# EAGLE design UP-Tasterschnittstelle1.2 (EAGLE 5.02)
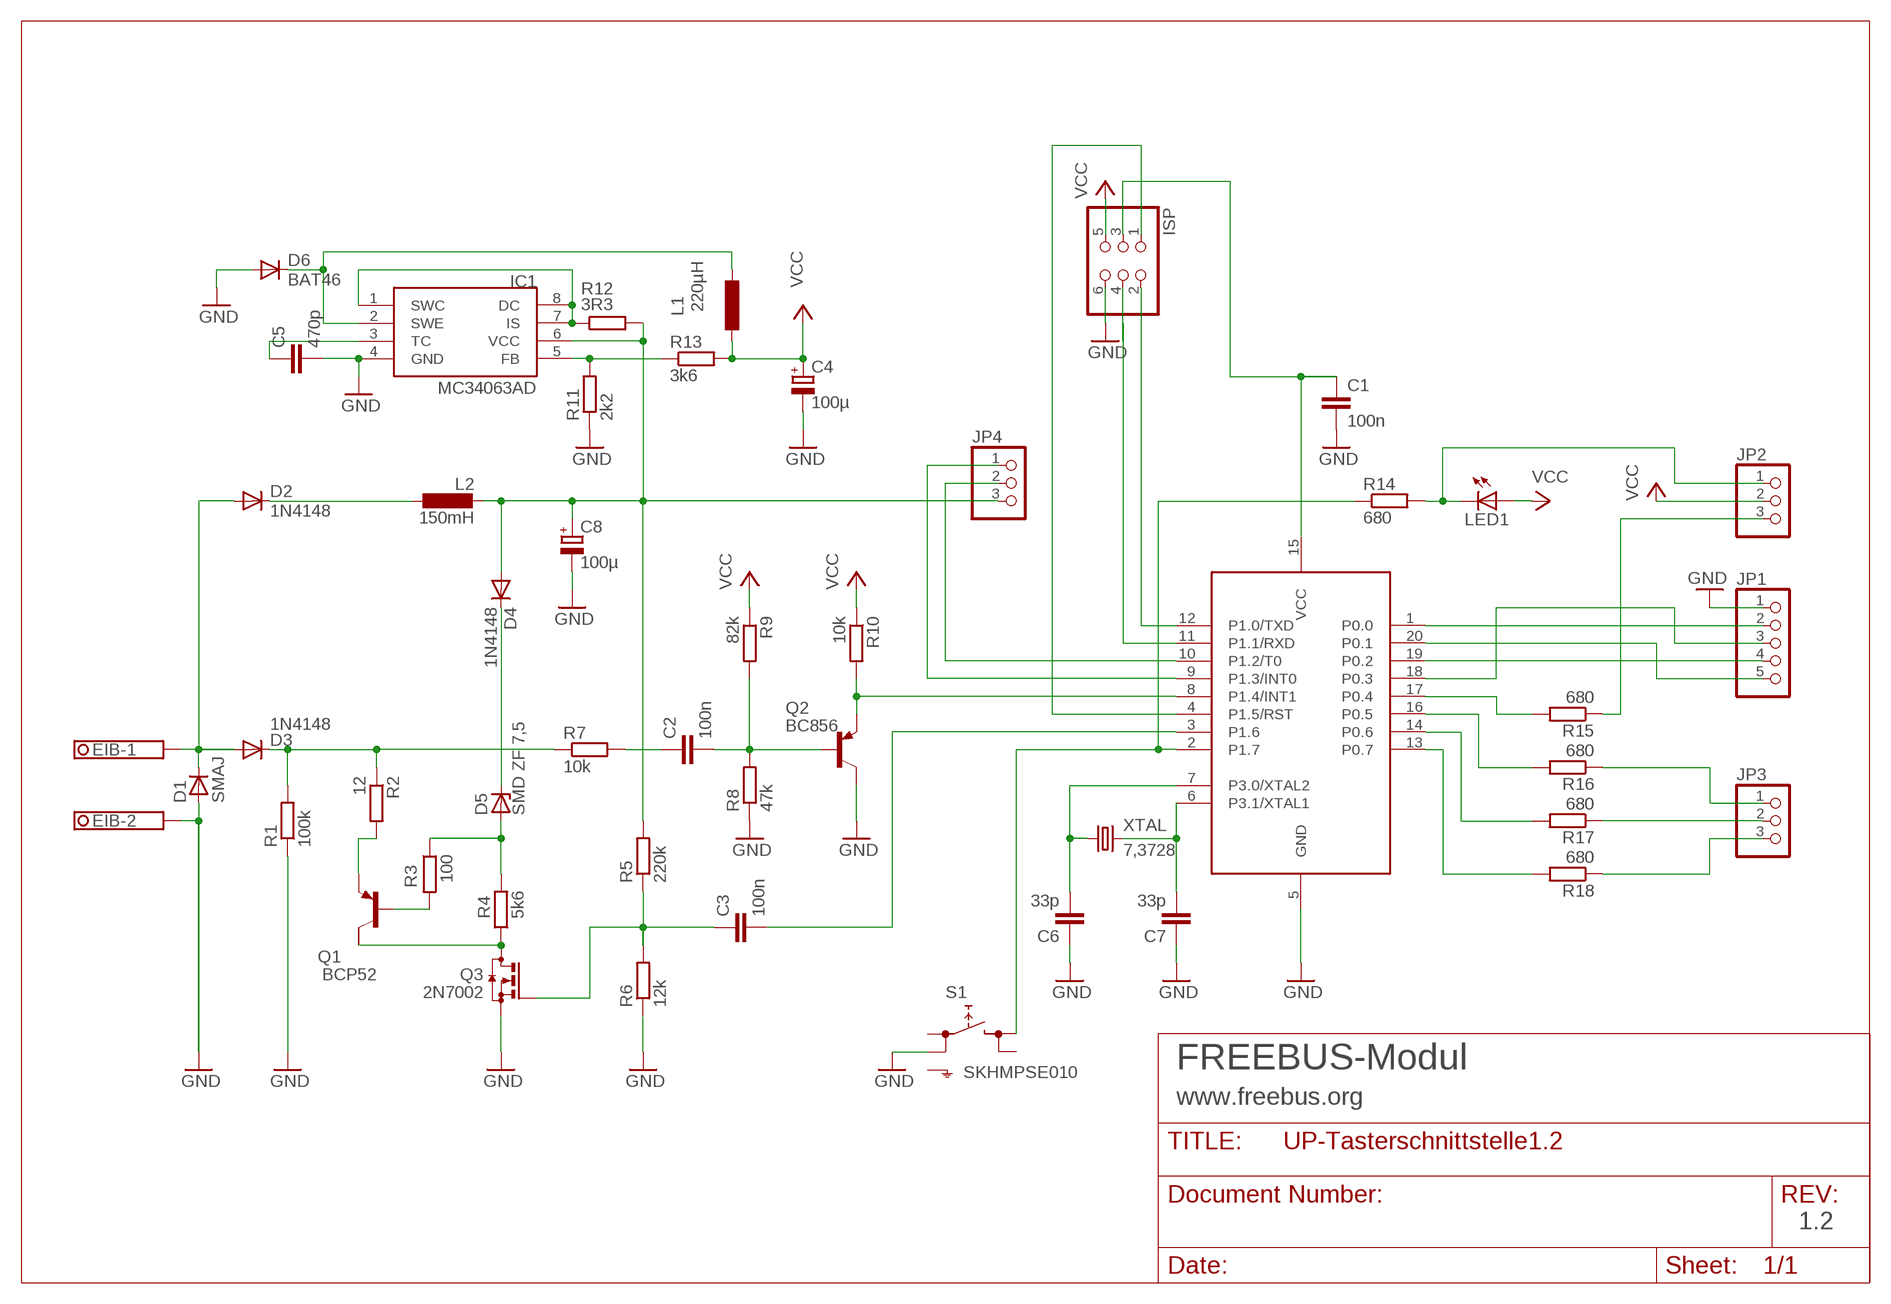
[diagram p0: schematic, sheet 1]

## Parts
C1  100n  C-EUC1206  [C1206]
C2  100n  C-EUC1206  [C1206]
C3  100n  C-EUC1206  [C1206]
C4  100µ  RCL_C_EU_H2-5X11  [2-5X11]
C5  470p  C-EUC1206  [C1206]
C6  33p  C-EUC1206  [C1206]
C7  33p  C-EUC1206  [C1206]
C8  100µ  RCL_C_EU_H3,5-8X13  [3,5-8X13]
D1  SMAJ  D-SMB  [SMB]
D2  1N4148  DIODE-MINIMELF  [MINIMELF]
D3  1N4148  DIODE-MINIMELF  [MINIMELF]
D4  1N4148  DIODE-MINIMELF  [MINIMELF]
D5  SMD ZF 7,5  ZPD  [MINIMELF]
D6  BAT46  DIODE-MINIMELF  [MINIMELF]
EIB  1751248  [1751248]
IC1  MC34063AD  [SOIC8]
IC2  LPC922FDH  [TSSOP20]
ISP  PINHD-2X3_2.00  [2X03M]
JP1  PINHD-1X5_2.00_STECKER  [1X5]
JP2  PINHD-1X3_2.00_STECKER  [1X3]
JP3  PINHD-1X3_2.00_STECKER  [1X3]
JP4  PINHD-1X3_2.00  [1X03M]
L1  220µH  L-EU2200-12.7  [2200-12.7]
L2  150mH  RCL_L-11P11PH  [RCL_11PH]
LED1  LEDCHIPLED_1206  [CHIPLED_1206]
Q1  BCP52  FZT753SMD  [SOT223]
Q2  BC856  BC856ALT1SMD  [SOT23-BEC]
Q3  2N7002  BSS123  [SOT23]
R1  100k  R-EU_M1206  [M1206]
R2  12  R-EU_R1206  [R1206]
R3  100  R-EU_R1206  [R1206]
R4  5k6  R-EU_R1206  [R1206]
R5  220k  R-EU_R1206  [R1206]
R6  12k  R-EU_R1206  [R1206]
R7  10k  R-EU_R1206  [R1206]
R8  47k  R-EU_M1206  [M1206]
R9  82k  R-EU_R1206  [R1206]
R10  10k  R-EU_R1206  [R1206]
R11  2k2  R-EU_R1206  [R1206]
R12  3R3  R-EU_M1206  [M1206]
R13  3k6  R-EU_M1206  [M1206]
R14  680  R-EU_R1206  [R1206]
R15  680  R-EU_R1206  [R1206]
R16  680  R-EU_R1206  [R1206]
R17  680  R-EU_R1206  [R1206]
R18  680  R-EU_R1206  [R1206]
S1  SKHMPSE010  [SKHMPXE010]
XTAL  7,3728  CRYSTAL_CRYSTALHC49S  [CRYSTAL_HC49/S]

## Nets
GND: C1.2 C4.- C5.2 C6.1 C7.1 C8.- D1.2(A) D6.A EIB.2 IC1.4(GND) IC2.5(GND) ISP.6 JP1.1 Q2.C Q3.2(S) R1.1 R6.1 R8.1 R11.1 S1.2(1.2)
IO1: IC2.1(P0.0) JP1.2
IO2: IC2.20(P0.1) JP1.5
IO3: IC2.19(P0.2) JP1.4
IO4: IC2.18(P0.3) JP1.3
LED1: JP2.3 R15.1
LED2: JP3.1 R16.1
LED3: JP3.2 R17.1
LED4: JP3.3 R18.1
N$5: C7.2 IC2.6(P3.1/XTAL1) XTAL.2
N$6: C6.2 IC2.7(P3.0/XTAL2) XTAL.1
N$7: C2.1 R7.2
N$8: IC2.2(P1.7) R14.1 S1.3(2.1)
N$10: IC2.9(P1.3/INT0) JP4.1
N$11: IC2.17(P0.4) R15.2
N$12: C8.+ D4.A IC1.6(VCC) JP4.3 L2.P$2 R5.2 R12.2
N$13: IC2.10(P1.2/T0) JP4.2
N$14: IC2.16(P0.5) R16.2
N$15: IC2.14(P0.6) R17.2
N$16: IC2.13(P0.7) R18.2
N$19: IC2.8(P1.4/INT1) Q2.E R10.2
N$23: C2.2 Q2.B R8.2 R9.2
N$24: C3.2 IC2.3(P1.6)
N$25: D3.C R1.2 R2.1 R7.1
N$26: IC1.5(FB) R11.2 R13.1
N$27: D6.C IC1.2(SWE) L1.2
N$28: C5.1 IC1.3(TC)
N$34: C3.1 Q3.1(G) R5.1 R6.2
N$36: D2.C L2.P$1
N$37: Q1.2(C) Q3.3(D) R4.1
N$38: D5.A R3.1 R4.2
N$39: Q1.3(E) R2.2
N$40: Q1.1(B) R3.2
N$41: D4.C D5.C
N$51: D1.1(C) D2.A D3.A EIB.1
N$61: IC1.1(SWC) IC1.7(IS) IC1.8(DC) R12.1
PROG_LED: JP2.1 LED1.C R14.2
RST: IC2.4(P1.5/RST) ISP.1
RXD: IC2.11(P1.1/RXD) ISP.4
TXD: IC2.12(P1.0/TXD) ISP.2
VCC: C4.+ ISP.5 JP2.2 L1.1 LED1.A R9.1 R10.1 R13.2
VCC_IN: C1.1 IC2.15(VCC) ISP.3
Unconnected: Q1.4(C/) S1.1(1.1) S1.4(2.2) S1.5(SH)

## Notes on the sheet
- FREEBUS-Modul
- www.freebus.org
- 1.2

## Library data of the parts
C1-C3 C5-C7 = rcl:C-EU: CAPACITOR, European symbol
C4 C8 = LPC_Gira3:RCL_C_EU_H
D1 = semicon-smd-ipc:D-: DIODE unfilled
D2-D4 D6 = diode:DIODE-: DIODE
D5 = diode:ZPD: Z DIODE 500 mW
EIB = con-phoenix-350:1751248: MKDS 1/ 2-3,5 Printklemme Nennstrom: 10 A Bemessungsspannung: 160 V Raster: 3,5 mm Polzahl: 2 Montageart: Löten Anschlussart: Schraubanschluss Anschlussrichtung vom Leiter zur Platine: 0° Source: http://eshop.phoenixcontact.com .. 1751248.pdf
IC1 = mc34063:MC34063
IC2 = LPCGira:LPC922FDH
ISP = pinhead2:PINHD-2X3: PIN HEADER
JP1 = pinhead2:PINHD-1X5: PIN HEADER
JP2-JP4 = pinhead2:PINHD-1X3: PIN HEADER
L1 = rcl:L-EU: INDUCTOR, European symbol
L2 = LPC_Gira3:RCL_L-11P
LED1 = led:LED: LED OSRAM: - CHIPLED LG R971, LG N971, LY N971, LG Q971, LY Q971, LO R971, LY R971 LH N974, LH R974 LS Q976, LO Q976, LY Q976 LO Q996 - Hyper CHIPLED LW Q18S LB Q993, LB Q99A, LB R99A - SideLED LS A670, LO A670, LY A670, LG A670, LP A670 LB A673, LV A673, LT A673, LW A673 LH A674 LY A675 LS A676, LA A676, LO A676, LY A676, LW A676 LS A679, LY A679, LG A679 - Hyper Micro SIDELED® LS Y876, LA Y876, LO Y876, LY Y876 LT Y87S - SmartLED LW L88C, LW L88S LB L89C, LB L89S, LG L890 LS L89K, LO L89K, LY L89K LS L896, LA L896, LO L896, LY L896 - TOPLED LS T670, LO T670, LY T670, LG T670, LP T670 LSG T670, LSP T670, LSY T670, LOP T670, LYG T670 LG T671, LOG T671, LSG T671 LB T673, LV T673, LT T673, LW T673 LH T674 LS T676, LA T676, LO T676, LY T676, LB T676, LH T676, LSB T676, LW T676 LB T67C, LV T67C, LT T67C, LS T67K, LO T67K, LY T67K, LW E67C LS E67B, LA E67B, LO E67B, LY E67B, LB E67C, LV E67C, LT E67C LW T67C LS T679, LY T679, LG T679 LS T770, LO T770, LY T770, LG T770, LP T770 LB T773, LV T773, LT T773, LW T773 LH T774 LS E675, LA E675, LY E675, LS T675 LS T776, LA T776, LO T776, LY T776, LB T776 LHGB T686 LT T68C, LB T68C - Hyper Mini TOPLED® LB M676 - Mini TOPLED Santana® LG M470 LS M47K, LO M47K, LY M47K Source: http://www.osram.convergy.de - LUMILED® LXK2-PW12-R00, LXK2-PW12-S00, LXK2-PW14-U00, LXK2-PW14-V00 LXK2-PM12-R00, LXK2-PM12-S00, LXK2-PM14-U00 LXK2-PE12-Q00, LXK2-PE12-R00, LXK2-PE12-S00, LXK2-PE14-T00, LXK2-PE14-U00 LXK2-PB12-K00, LXK2-PB12-L00, LXK2-PB12-M00, LXK2-PB14-N00, LXK2-PB14-P00, LXK2-PB14-Q00 LXK2-PR12-L00, LXK2-PR12-M00, LXK2-PR14-Q00, LXK2-PR14-R00 LXK2-PD12-Q00, LXK2-PD12-R00, LXK2-PD12-S00 LXK2-PH12-R00, LXK2-PH12-S00 LXK2-PL12-P00, LXK2-PL12-Q00, LXK2-PL12-R00 Source: www.luxeon.com
Q1 = transistor-pnp:FZT753SMD: PNP Transistor
Q2 = transistor-pnp:BC856*: PNP Transistror
Q3 = transistor-small-signal:BSS123: N-CHANNEL MOS FET
R1-R18 = rcl:R-EU_: RESISTOR, European symbol
S1 = switch:SKHMP*E010: 6.2 X 6.5mm TACT Switch (SMD) Source: http://www3.alps.co.jp/WebObjects/catalog.woa/PDF/E/Switch/Tact/SKHM/SKHM.PDF
XTAL = LPCGira:CRYSTAL_CRYSTAL: CRYSTAL

## Board
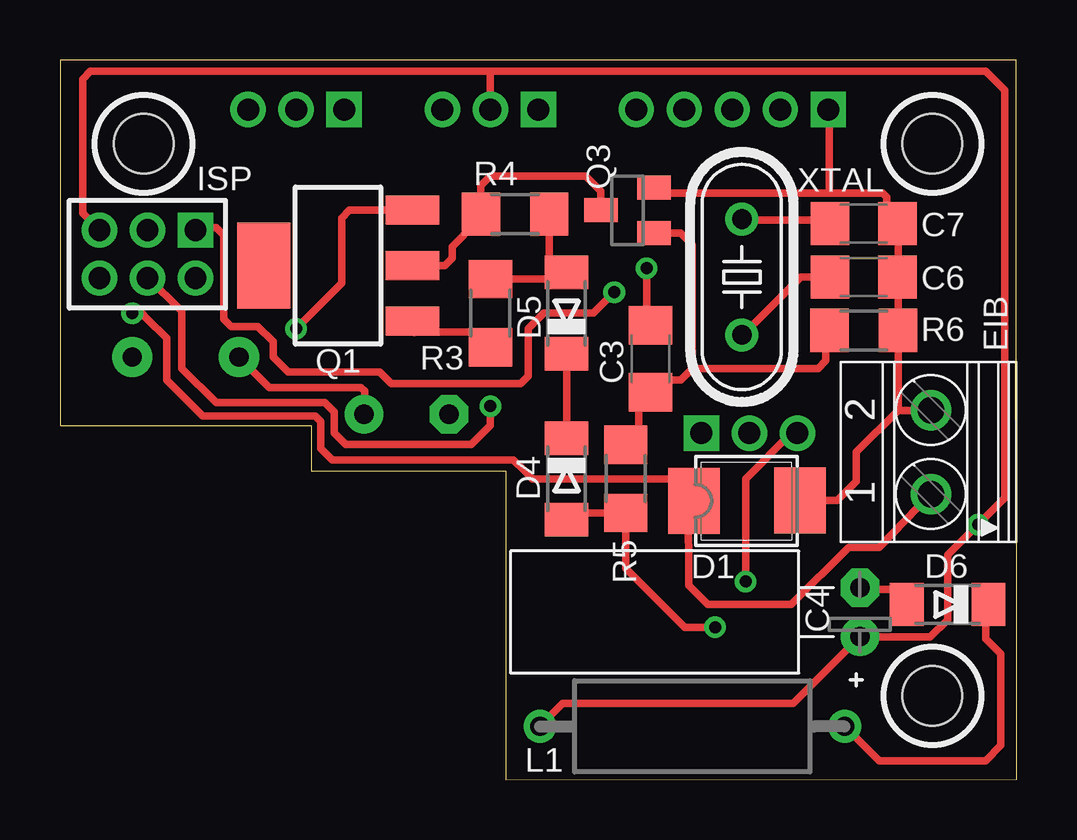
[diagram p1: board, top side]
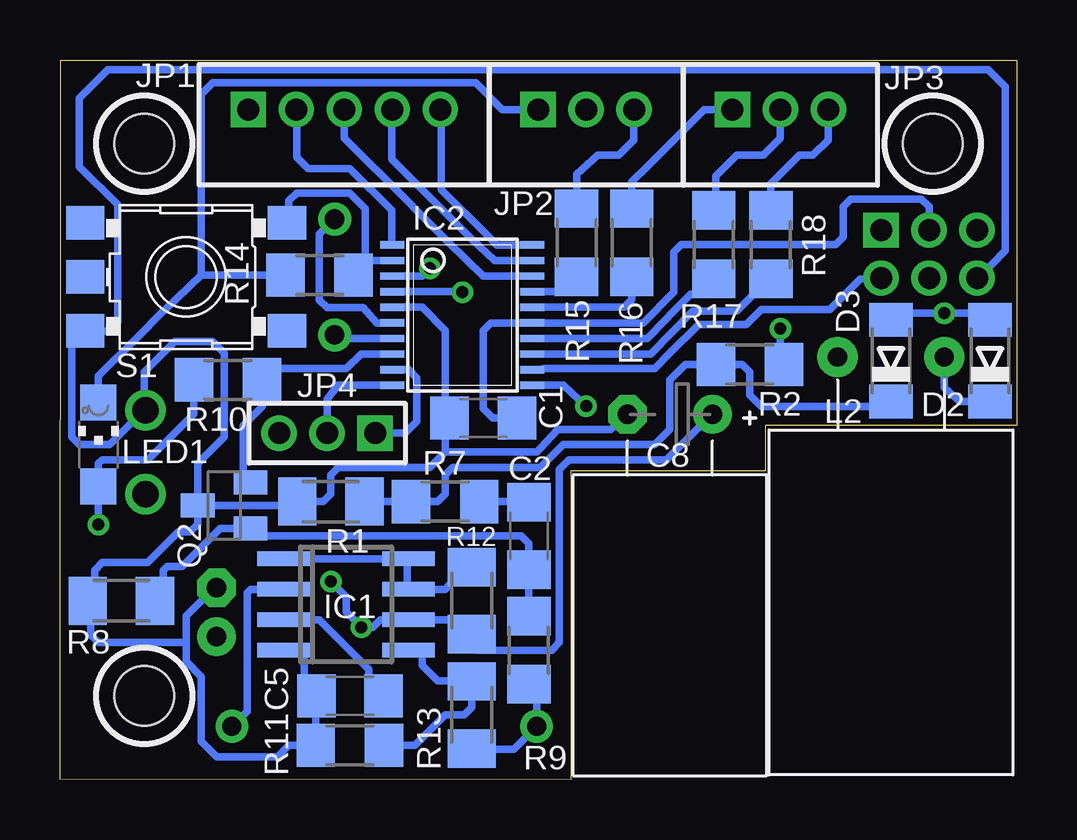
[diagram p2: board, bottom side, seen from below]

Size 39.85 x 30 mm. Coordinates in mm from the lower left corner, seen from the top.
Outline: 39.83,30 39.85,0.01 18.57,0 18.57,12.86 10.47,12.86 10.47,14.77 0,14.77 0,30 27.77,30 39.83,30
Outline: 39.84,30 39.83,30
Copper layers (1*16): Top 0.035mm / dielectric 1.5mm / Bottom 0.035mm
Design rules "ZWILLING 11mil": minimum track width 0.2mm, minimum drill 0.5mm, track to track 0.2mm, track to pad 0.2mm, pad to pad 0.2mm, via to via 0.2mm, smd to smd 0mil, copper to edge 0.2mm, drill to drill 0.2mm, minimum pad ring 11mil, minimum via ring 0.2mm, stop-mask expansion 0.1mm, vias tented up to drill 0mil, thermal gap 10mil
Holes 2.49 mm at 3.49,26.51 36.35,3.49 36.35,26.51

### Footprints (pad centres in the part's own frame; a part is rotated, then mirrored left to right if it is on the bottom)
C1206 = smd 1.6 x 1.8: 1 -1.4,0; 2 1.4,0
2-5X11 = drill 0.813 pad 1.6 round: + -1.02,0 | drill 0.813 pad 1.6 octagon: - 1.02,0
3,5-8X13 = drill 0.813 pad 1.6 round: + -1.77,-0.31 | drill 0.813 pad 1.6 octagon: - 1.77,-0.31
SMB = smd 2.159 x 2.743: 1 -2.311,-0.127; 2 2.108,-0.102
MINIMELF = smd 1.4 x 1.8: A 1.7,0; C -1.7,0
1751248 = drill 1.1 pad 1.7 round: 1 -1.75,-0.1; 2 1.75,-0.1
SOIC8 = smd 0.6 x 2.2: 1 -1.905,-2.6; 2 -0.635,-2.6; 3 0.635,-2.6; 4 1.905,-2.6; 5 1.905,2.6; 6 0.635,2.6; 7 -0.635,2.6; 8 -1.905,2.6
TSSOP20 = smd 0.305 x 0.991: 1 -2.925,-2.918; 2 -2.275,-2.918; 3 -1.625,-2.918; 4 -0.975,-2.918; 5 -0.325,-2.918; 6 0.325,-2.918; 7 0.975,-2.918; 8 1.625,-2.918; 9 2.275,-2.918; 10 2.925,-2.918; 11 2.925,2.918; 12 2.275,2.918; 13 1.625,2.918; 14 0.975,2.918; 15 0.325,2.918; 16 -0.325,2.918; 17 -0.975,2.918; 18 -1.625,2.918; 19 -2.275,2.918; 20 -2.925,2.918
2X03M = drill 0.914 square: 1 -2,-1 | drill 0.914 round: 2 -2,1; 3 0,-1; 4 0,1; 5 2,-1; 6 2,1
1X5 = drill 0.914 square: 1 -4,0 | drill 0.914 round: 2 -2,0; 3 0,0; 4 2,0; 5 4,0
1X3 = drill 0.914 square: 1 -2,0 | drill 0.914 round: 2 0,0; 3 2,0
1X03M = drill 0.914 square: 1 -2,0 | drill 0.914 round: 2 0,0; 3 2,0
2200-12.7 = drill 0.8 pad 1.27 round: 1 -6.35,0; 2 6.35,0
RCL_11PH = drill 0.8 pad 1.676 round: P$1 -2.223,0; P$2 2.223,0
CHIPLED_1206 = smd 1.5 x 1.5: A 0,-1.75; C 0,1.75
SOT223 = smd 1.219 x 2.235: 1 -2.311,-3.099; 2 0,-3.099; 3 2.311,-3.099 | smd 3.6 x 2.2: 4 0,3.099
SOT23-BEC = smd 1 x 1.4: B -0.95,-1.1; C 0,1.1; E 0.95,-1.1
SOT23 = smd 1 x 1.4: 1 -0.95,-1.1; 2 0.95,-1.1; 3 0,1.1
M1206 = smd 1.6 x 2: 1 -1.4,0; 2 1.4,0
R1206 = smd 1.6 x 1.803: 1 -1.422,0; 2 1.422,0
SKHMPXE010 = smd 1.6 x 1.4: 1 -4.2,2.25; 2 4.2,2.25; 3 -4.2,-2.25; 4 4.2,-2.25; 5 4.2,0
CRYSTAL_HC49/S = drill 0.813 round: 1 -2.413,0; 2 2.413,0

### Placement (x,y rotation side)
C1  22.22,15.08 180 bottom
C2  20.31,10.16 270 bottom
C3  24.6,17.54 90 top
C4  33.33,6.99 90 top
C5  27.78,3.49 180 bottom
C6  33.49,20.95 180 top
C7  33.49,23.18 180 top
C8  14.44,14.92 180 bottom
D1  28.73,11.75 0 top
D2  1.11,17.46 90 bottom
D3  5.23,17.46 90 bottom
D4  21.11,12.54 270 top
D5  21.11,19.45 90 top
D6  36.98,7.3 180 top
EIB  36.19,13.65 90 top
IC1  27.93,7.3 270 bottom
IC2  23.09,19.37 270 bottom
ISP  3.65,21.91 180 top
JP1  28.01,27.94 0 bottom
JP2  17.93,27.94 0 bottom
JP3  9.84,27.94 0 bottom
JP4  28.73,14.45 180 bottom
L1  26.35,2.22 0 top
L2  5.23,17.62 180 bottom
LED1  38.25,13.97 0 bottom
Q1  11.58,21.43 90 top
Q2  33.01,11.43 90 bottom
Q3  23.65,23.73 90 top
R1  28.57,11.59 0 bottom
R2  11.11,17.3 0 bottom
R3  17.93,19.45 270 top
R4  18.96,23.57 0 top
R5  23.57,12.54 270 top
R6  33.49,18.73 180 top
R7  23.81,11.59 0 bottom
R8  37.3,7.46 0 bottom
R9  20.31,5.4 90 bottom
R10  32.85,16.67 0 bottom
R11  27.78,1.43 0 bottom
R12  22.7,7.46 270 bottom
R13  22.7,2.7 270 bottom
R14  29.05,21.03 180 bottom
R15  18.33,22.38 270 bottom
R16  16.03,22.38 270 bottom
R17  12.61,22.3 270 bottom
R18  10.23,22.3 270 bottom
S1  34.6,20.96 180 bottom
XTAL  28.41,20.96 90 top

### Tracks (layer width: path | path; a pad name or v marks a point on that pad's centre or on a via)
GND
  Top 0.305: D1.2 32.38,11.65 33.17,12.44 33.17,13.65 34.92,15.4 | EIB.2 36.35,15.4 36.19,15.4 34.92,15.4 | C4.- 33.49,7.94 35.24,7.94 35.24,7.3 D6.A | 34.92,20.95 34.92,23.18 | 34.92,15.4 | 34.92,15.4 R6.1 | R6.1 | R6.1 34.92,20.8 | 33.33,24.45 34.28,24.45 34.44,24.29 34.44,23.18 34.92,23.18 | 33.33,24.45 32.06,24.45 | 32.06,24.45 30.95,24.45 27.77,24.45 24.76,24.45 Q3.2 | 34.92,23.18 C7.1 | 34.92,20.8 34.92,20.95 | 34.92,20.95 C6.1 | 34.92,20.8 | 33.33,24.45 | JP1.1 32.06,27.94 32.06,24.45
  Bottom 0.305: 39.05,28.42 37.86,29.61 32.38,29.61 3.33,29.61 1.18,29.61 0.47,28.89 0.47,22.07 1.58,20.91 ISP.6 | 30,11.59 30,11.75 30.16,11.43 Q2.C | 30,11.59 28.89,11.59 28.57,11.91 28.57,12.7 28.25,13.02 24.44,13.02 23.81,13.65 | 19.84,13.81 19.12,14.61 16.9,14.61 16.19,15.23 | 28.57,4.13 C5.2 29.2,3.65 | 34.6,5.71 34.6,6.83 33.33,8.1 C4.- | 29.2,3.65 | 29.2,3.65 29.2,1.91 R11.1 30.31,1.43 30.79,0.95 33.33,0.95 33.97,1.59 33.97,4.29 34.6,4.92 34.6,5.71 | 29.2,3.65 29.68,3.65 29.68,5.4 IC1.4 | 30,11.59 R1.1 | 16.19,15.23 16.19,15.24 | 16.19,15.23 C8.- | 39.05,28.42 | 39.05,28.42 39.05,25.56 37.46,23.97 37.46,19.37 37.46,19.05 37.78,18.7 S1.2 39.36,18.7 39.36,14.29 39.05,13.97 37.78,13.97 36.35,15.4 | 19.84,13.81 20,13.65 23.81,13.65 | 19.84,13.81 | 23.81,13.65 23.81,15.08 | IC2.5 24.76,19.69 23.81,18.73 23.81,15.08 | 23.81,15.08 23.96,15.08 C1.2 | 34.6,5.71 38.25,5.71 38.57,6.03 38.57,7.46 R8.1 38.41,7.46 38.41,8.73 38.09,9.05 36.19,9.05 34.92,10.32 34.44,10.32 34.12,10.64 Q2.C | Q2.C 34.12,13.18 33.01,14.29 33.01,17.78 33.33,18.1 33.49,18.26 35.08,18.26 36.35,16.99 36.35,15.4 | 36.35,15.4 | 36.35,15.4 EIB.2
IO1
  Bottom 0.305: IC2.1 26.03,22.29 26.03,23.73 27.77,25.48 29.52,25.48 30,25.96 | JP1.2 30,27.94 30,25.96 | 30,25.96
IO2
  Bottom 0.305: IC2.20 21.66,22.29 22.06,22.7 | 22.06,22.7 | 22.06,22.7 23.96,24.61 23.96,27.94 JP1.5
IO3
  Bottom 0.305: IC2.19 21.74,21.64 22.69,22.54 | 22.69,22.54 | 22.69,22.54 26.03,25.88 | JP1.4 26.03,27.94 26.03,25.88 | 26.03,25.88
IO4
  Bottom 0.305: IC2.18 22.22,20.99 23.65,22.38 23.96,22.7 24.92,23.65 25.39,24.13 28.01,26.75 JP1.3
LED1
  Bottom 0.305: R15.1 18.33,24.12 18.33,25.24 17.46,26.04 16.58,26.04 15.95,26.67 | JP2.3 15.95,27.94 15.95,26.67 | 15.95,26.67
LED2
  Bottom 0.305: R16.1 16.03,24.92 15.39,25.56 13.01,27.94 JP3.1 11.82,27.94
LED3
  Bottom 0.305: R17.1 12.53,23.73 12.53,25.16 11.66,26.04 10.55,26.04 9.84,26.75 JP3.2
LED4
  Bottom 0.305: R18.1 10.23,24.84 9.04,26.04 8.49,26.04 7.85,26.67 | JP3.3 7.85,27.94 7.85,26.67 | 7.85,26.67
N$5
  Top 0.305: XTAL.2 | C7.2 32.06,23.18 32.06,23.34 28.41,23.34 XTAL.2
  Bottom 0.305: IC2.6 26.66,19.04 27.22,19.68 28.73,19.68 29.04,20 29.04,20.08 29.04,21.91 29.04,22.73 XTAL.2
N$6
  Top 0.305: C6.2 30.87,20.95 28.41,18.49 | 28.41,18.49 XTAL.1 28.41,18.49
  Bottom 0.305: XTAL.1 28.41,18.41 28.41,18.38 27.77,18.39 IC2.7
N$7
  Bottom 0.305: C2.1 20.31,11.59 R7.2
N$8
  Bottom 0.305: 27.14,23.81 27.77,24.45 30,24.45 30.31,24.13 30.31,23.2 S1.3 | R14.1 | R14.1 | 27.14,21.64 27.62,21.64 R14.1 | 27.14,21.64 IC2.2 | 27.14,21.64 27.14,21.59 | 27.14,23.81 | 27.14,21.64 27.14,23.81
N$10
  Bottom 0.305: IC2.9 25.31,17.09 25,16.75 25,14.92 25.47,14.45 JP4.1
N$11
  Bottom 0.305: R15.2 18.88,20.96 18.88,20.34 IC2.17
N$12  (via drill 0.5)
  Top 0.305: v27.3,6.35 26.03,6.35 23.57,8.81 23.57,10.09 R5.2 21.03,11.12 21.03,11.08 D4.A | C8.+ 12.69,15.23 12.69,16.19 12.53,16.35 12.22,16.35 8.72,16.35 L2.P$2 | JP4.3 30.47,14.45 28.57,12.54 v28.57,8.26
  Bottom 0.305: 22.54,6.67 IC1.6 26.5,6.67 26.82,6.35 v27.3,6.35 27.93,6.99 27.93,7.62 v28.57,8.26 | 22.54,6.38 22.54,6.35 | 22.54,6.38 R12.2 | 22.54,6.67 22.54,6.38 | 22.54,6.67 22.54,5.4 19.36,5.4 19.04,5.71 19.04,12.94 18.65,13.34 14.6,13.34 12.69,15.23 | 12.69,15.23 12.69,15.24 | C8.+ 12.69,15.23
N$13
  Bottom 0.305: IC2.10 28.25,16.44 28.73,15.88 JP4.2 | JP4.2
N$14
  Bottom 0.305: R16.2 16.03,20.01 16.34,19.69 IC2.16
N$15
  Bottom 0.305: IC2.14 19.52,18.39 15.39,18.39 14.6,19.21 14.36,19.45 13.57,20.24 12.22,20.25 R17.2
N$16
  Bottom 0.254: 10.63,20.56
  Bottom 0.305: IC2.13 15.23,17.74 13.49,19.53 11.66,19.53 10.63,20.56 R18.2
N$19
  Bottom 0.305: IC2.8 27.3,17.74 27.93,17.14 28.01,17.14 29.52,17.14 29.84,17.14 31.43,17.14 | Q2.E 32.22,12.38 32.22,14.76 31.43,15.56 31.43,17.14 | 31.43,17.14 R10.2
N$23
  Bottom 0.305: 20.63,10.16 31.27,10.16 31.74,10.48 | R9.2 20.47,6.67 | 20,6.98 R9.2 | R9.2 C2.2 20.31,9.84 20.63,10.16 | R8.2 35.87,7.43 35.55,7.43 35.55,8.73 35.39,8.89 34.76,8.89 33.17,10.48 31.74,10.48 | 20.63,10.16 | 31.74,10.48 31.9,10.48 Q2.B
N$24  (via drill 0.5)
  Top 0.305: C3.2 24.44,19.34 24.44,19.82 24.44,19.92 v24.44,21.32
  Bottom 0.305: IC2.3 25.79,20.99 24.76,20.99 v24.44,21.32
N$25
  Bottom 0.305: R7.1 25.23,12.06 R7.1 | R7.1 R1.2 | R7.1 24.12,11.59 23.81,11.91 23.81,12.7 23.49,13.02 19.84,13.02 18.89,13.97 15.08,13.97 14.44,14.61 14.44,16.67 13.8,17.3 12.53,17.3 | 4.91,15.56 4.91,15.6 D3.C | 4.91,15.56 10.47,15.56 10.63,15.56 11.11,16.03 11.11,16.99 11.42,17.3 11.58,17.3 R2.1 12.53,17.3 | 4.91,15.56 | 12.53,17.3
N$26
  Bottom 0.305: R11.2 25.08,1.43 23.81,2.7 23.01,2.7 22.69,3.02 22.69,4.13 | 23.01,3.81 R13.1 22.69,4.13 | IC1.5 24.76,5.4 24.76,4.76 24.12,4.13 22.69,4.13
N$27
  Top 0.305: L1.2 34.12,0.79 38.57,0.79 39.2,1.43 39.2,5.24 38.57,5.87 38.57,7.3 D6.C
  Bottom 0.305: IC1.2 31.9,7.94 32.06,7.78 32.06,2.86 L1.2
N$28
  Bottom 0.305: IC1.3 29.04,6.67 26.98,4.6 26.98,4.13 C5.1
N$34
  Top 0.305: Q3.1 25.87,22.78 26.35,22.3 26.35,17.14 | 26.35,17.14 25.87,16.67 25.08,16.67 24.76,16.35 24.68,16.03 | R6.2 31.9,18.73 31.9,17.46 31.58,17.14 26.35,17.14 | R5.1 24.12,13.96 24.12,15.95 24.68,16.03 | 24.68,16.03 C3.1
N$36
  Bottom 0.305: D2.C 2.37,15.76 3.01,16.35 L2.P$1
N$37
  Top 0.305: Q1.2 14.76,21.11 14.76,21.19 | Q3.3 22.54,24.53 21.9,25.16 17.93,25.16 17.54,24.77 R4.1 | R4.1 17.54,23.5 | R4.1 16.82,22.7 16.34,22.23 16.34,21.75 16.03,21.43 Q1.2 | Q1.2 14.68,21.11
N$38
  Top 0.305: R3.1 20.39,20.88 20.39,21.11 | 20.39,21.11 R4.2 | 20.39,21.11 | D5.A 20.39,21.15 20.39,21.11
N$39  (via drill 0.5)
  Top 0.305: v9.84,18.8 11.74,20.71 11.74,23.42 12.06,23.74 Q1.3
  Bottom 0.305: 9.84,18.57 v9.84,18.8 | R2.2 9.84,17.46 9.84,18.57 | 9.84,18.57
N$40
  Top 0.305: Q1.1 14.76,18.64 14.76,18.65 17.85,18.65 17.85,18.02 | 17.85,18.02 | 17.85,18.02 R3.2
N$41
  Top 0.305: D4.C 21.11,14.64 21.11,15.48 21.11,15.88 21.11,16.35 21.11,16.87 D5.C
N$51  (via drill 0.5)
  Top 0.305: EIB.1 34.12,9.68 32.85,9.68 30.47,7.3 26.98,7.3 26.19,8.1 26.19,11.59 | 26.19,11.59 26.35,11.62 D1.1 | 26.19,11.59 26.03,12.54 19.68,12.54 19.36,12.86 18.88,13.34 11.34,13.34 10.87,13.81 10.87,14.92 10.63,15.16 5.95,15.16 4.44,16.67 4.44,18.41 3.64,19.21 3.41,19.45 v3.01,19.45
  Bottom 0.305: D2.A 1.1,19 1.1,19.45 v3.01,19.45 | D3.A 4.91,19 4.91,19.45 v3.01,19.45 | v3.01,19.45
N$61
  Bottom 0.305: IC1.1 IC1.8 25.39,9.21 25.39,8.26 IC1.7 23.81,7.94 22.85,9.02 | 22.85,9.02 22.54,9.05 | R12.1 22.85,9.02
PROG_LED
  Bottom 0.305: 33.97,21.04 R14.2 | 33.97,21.04 35.47,19.61 35.55,19.53 36.66,18.41 38.25,16.83 LED1.C | LED1.C | 33.97,21.04 33.97,22.54 33.97,28.57 33.49,29.05 22.54,29.05 21.42,27.94 19.92,27.94 | 19.92,27.94 JP2.1 | 19.92,27.94
RST  (via drill 0.5)
  Top 0.305: v23.09,20.32 22.93,20.16 22.22,19.45 20.15,19.45 19.52,18.81 19.52,16.83 19.2,16.51 13.8,16.51 13.33,16.99 9.52,16.99 8.88,17.62 8.88,18.26 8.25,18.89 7.14,18.89 6.82,19.21 6.82,22.7 6.5,23.02 5.71,23.02 5.71,22.91 ISP.1
  Bottom 0.305: v23.09,20.32 | IC2.4 23.09,20.34 v23.09,20.32
RXD  (via drill 0.5)
  Top 0.305: v17.93,15.57 17.93,14.76 17.14,13.97 11.9,13.97 11.42,14.45 11.42,15.32 11.03,15.72 6.5,15.72 5.07,17.14 5.07,19.53 3.64,20.95 ISP.4
  Bottom 0.305: IC2.11 18.89,16.44 17.93,15.56 v17.93,15.57
TXD
  Bottom 0.305: IC2.12 19.84,17.09 19.68,17.14 15.71,17.14 15.07,17.14 14.44,17.78 13.25,18.97 11.27,18.97 10.63,19.61 7.77,19.61 6.5,20.88 5.71,20.91 ISP.2
VCC  (via drill 0.5)
  Top 0.305: 17.93,29.53 1.26,29.53 0.95,29.21 0.95,23.62 ISP.5 | L1.1 20.95,3.17 30.55,3.17 C4.+ | C4.+ | C4.+ 36.27,5.95 36.98,6.67 36.98,9.37 v38.25,10.64 | 17.93,29.53 18.09,29.53 38.57,29.53 39.36,28.73 39.36,11.75 v38.25,10.64 | v38.25,10.64 | 17.93,29.53 | JP2.2 | 17.93,29.53 JP2.2
  Bottom 0.2: LED1.A 37.93,12.7
  Bottom 0.305: 20.79,4.13 R9.1 20,4.29 L1.1 20.95,1.27 22.54,1.27 R13.2 | LED1.A 38.25,13.18 38.09,13.34 36.19,13.34 35.47,14.05 34.28,15.24 R10.1 | R10.1 34.28,16.83 | R10.1 | LED1.A | v38.25,10.64 LED1.A
VCC_IN
  Bottom 0.305: 3.64,22.86 ISP.3 3.64,23.89 3.96,24.21 6.9,24.21 7.22,23.89 7.22,22.62 7.53,22.3 13.96,22.3 14.28,21.99 14.28,20.32 15.55,19.04 IC2.15 21.9,19.04 22.22,18.73 22.22,15.48 21.82,15.08 21.11,15.08 C1.1